# EAGLE schematic heated bed (EAGLE 6.2)
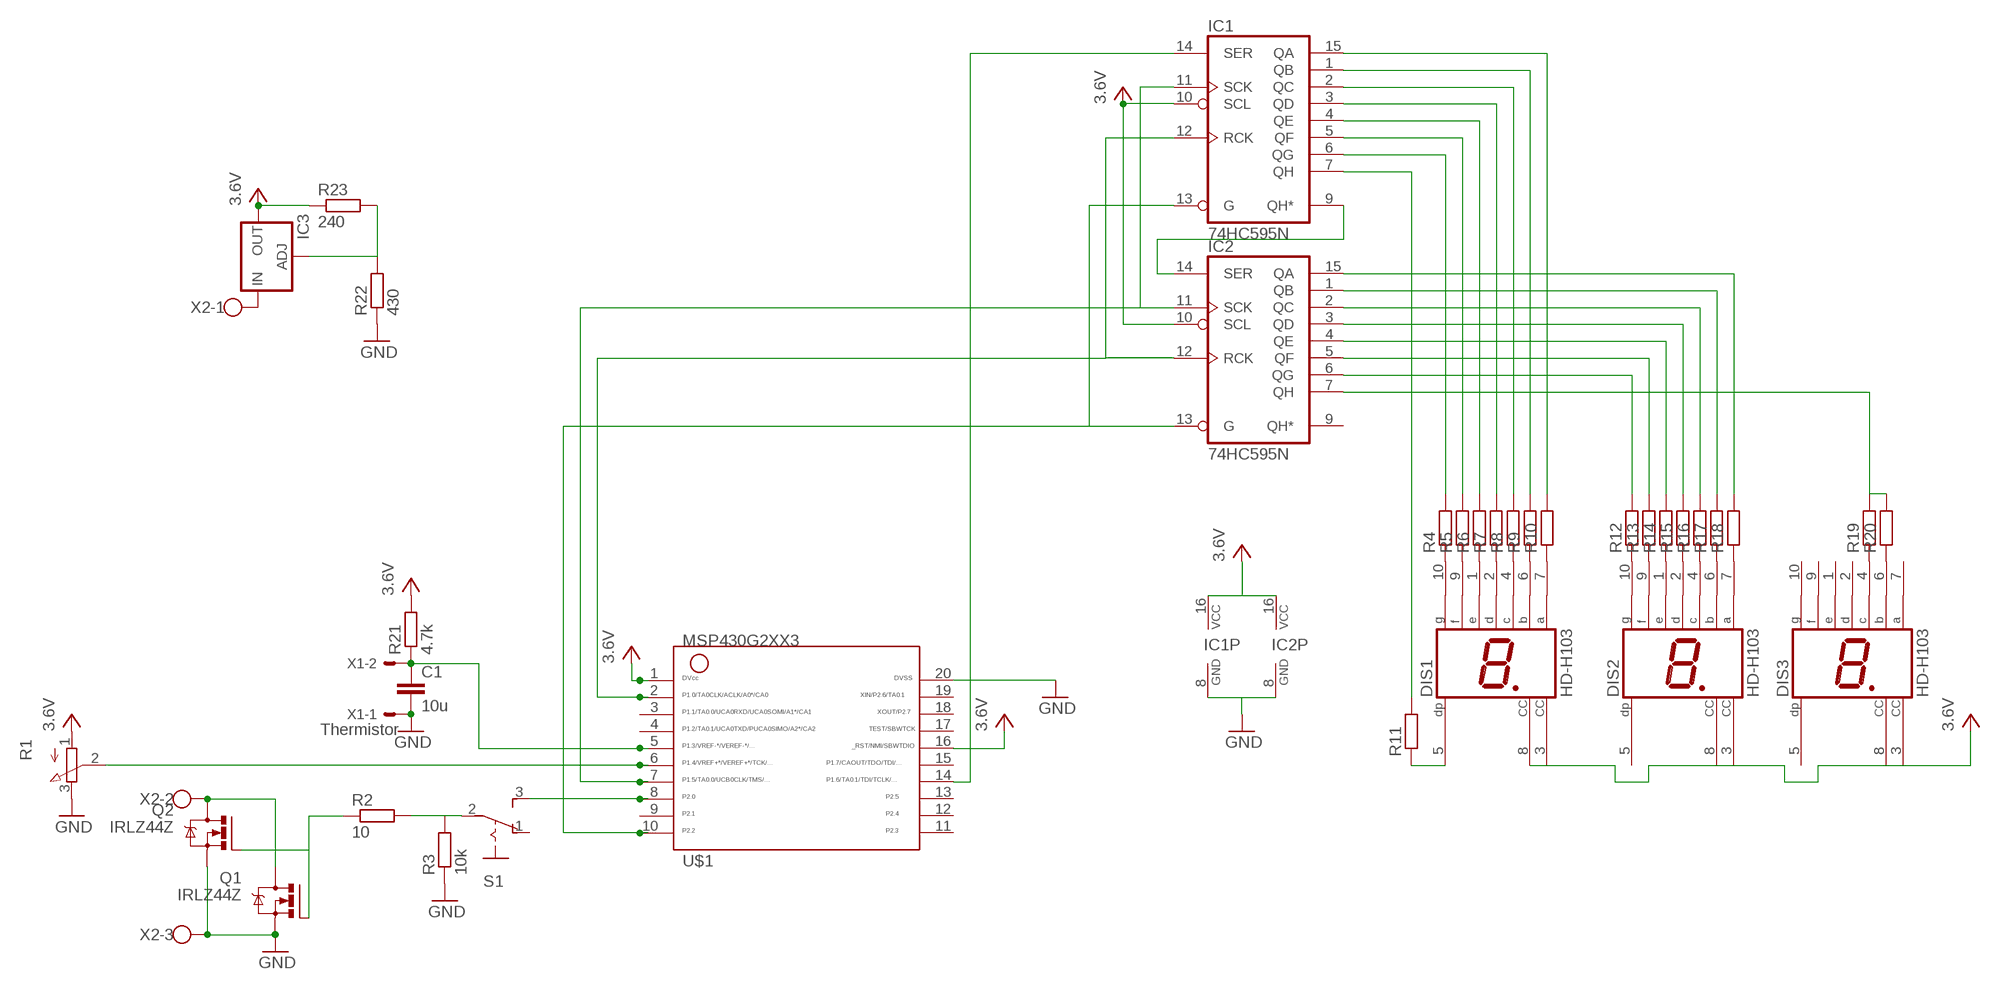
[diagram p0: schematic, sheet 1]

## Parts
C1  10u  C-EU025-050X050  [C025-050X050]
DIS1  HD-H103  [HDSP-M]
DIS2  HD-H103  [HDSP-M]
DIS3  HD-H103  [HDSP-M]
IC1  74HC595N  [DIL16]
IC2  74HC595N  [DIL16]
IC3  LM317L  [317L]
Q1  IRLZ44Z  [TO220BH]
Q2  IRLZ44Z  [TO220BH]
R1  3RP/1610N  [3RP/1610N]
R2  10  R-EU_0207/2V  [0207/2V]
R3  10k  R-EU_0207/2V  [0207/2V]
R4  R-EU_0207/2V  [0207/2V]
R5  R-EU_0207/2V  [0207/2V]
R6  R-EU_0207/2V  [0207/2V]
R7  R-EU_0207/2V  [0207/2V]
R8  R-EU_0207/2V  [0207/2V]
R9  R-EU_0207/2V  [0207/2V]
R10  R-EU_0207/2V  [0207/2V]
R11  R-EU_0207/2V  [0207/2V]
R12  R-EU_0207/2V  [0207/2V]
R13  R-EU_0207/2V  [0207/2V]
R14  R-EU_0207/2V  [0207/2V]
R15  R-EU_0207/2V  [0207/2V]
R16  R-EU_0207/2V  [0207/2V]
R17  R-EU_0207/2V  [0207/2V]
R18  R-EU_0207/2V  [0207/2V]
R19  R-EU_0207/2V  [0207/2V]
R20  R-EU_0207/2V  [0207/2V]
R21  4.7k  R-EU_0207/2V  [0207/2V]
R22  430  R-EU_0207/2V  [0207/2V]
R23  240  R-EU_0207/2V  [0207/2V]
S1  255SB  [255SB]
U$1  G2XX3---N20  [N20]
X1  Thermistor  22-23-2021  [22-23-2021]
X2  W237-103  [W237-103]

## Nets
GND: C1.2 IC1.8(GND) IC2.8(GND) Q1.S Q2.S R1.3(E) R3.1 R22.1 U$1.20 X1.1 X2.3
N$1: R1.2(S) U$1.6
N$2: IC1.11(SCK) IC2.11(SCK) U$1.7
N$3: R2.2 R3.2 S1.2(P)
N$4: IC1.12(RCK) IC2.12(RCK) U$1.2
N$5: IC1.9(QH*) IC2.14(SER)
N$6: IC1.13(G) IC2.13(G) U$1.10
N$7: DIS1.10(G) R4.1
N$8: DIS1.9(F) R5.1
N$9: DIS1.1(E) R6.1
N$10: DIS1.2(D) R7.1
N$11: DIS1.4(C) R8.1
N$12: DIS1.6(B) R9.1
N$13: DIS1.7(A) R10.1
N$14: DIS2.10(G) R12.1
N$15: DIS2.9(F) R13.1
N$16: DIS2.1(E) R14.1
N$17: DIS2.2(D) R15.1
N$18: DIS2.4(C) R16.1
N$19: DIS2.6(B) R17.1
N$20: DIS2.7(A) R18.1
N$21: DIS3.4(C) R19.1
N$22: DIS3.6(B) R20.1
N$23: DIS1.5(DP) R11.1
N$24: IC1.15(QA) R10.2
N$25: IC1.1(QB) R9.2
N$26: IC1.2(QC) R8.2
N$27: IC1.3(QD) R7.2
N$28: IC1.4(QE) R6.2
N$29: IC1.5(QF) R5.2
N$30: IC1.6(QG) R4.2
N$31: IC1.7(QH) R11.2
N$32: IC2.7(QH) R19.2 R20.2
N$33: IC2.15(QA) R18.2
N$34: IC2.1(QB) R17.2
N$35: IC2.2(QC) R16.2
N$36: IC2.3(QD) R15.2
N$37: IC2.4(QE) R14.2
N$38: IC2.5(QF) R13.2
N$39: IC2.6(QG) R12.2
N$40: S1.3(S) U$1.8
N$41: Q1.G Q2.G R2.1
N$42: Q1.D Q2.D X2.2
N$44: IC3.3(IN) X2.1
N$45: IC1.14(SER) U$1.14
N$47: C1.1 R21.1 U$1.5 X1.2
N$48: IC3.1(ADJ) R22.2 R23.2
VCC: DIS1.3(CC) DIS1.8(CC) DIS2.3(CC) DIS2.8(CC) DIS3.3(CC) DIS3.8(CC) IC1.10(SCL) IC1.16(VCC) IC2.10(SCL) IC2.16(VCC) IC3.2(OUT) R1.1(A) R21.2 R23.1 U$1.1 U$1.16 ; supply symbol labelled 3.6V
Unconnected: DIS2.5(DP) DIS3.1(E) DIS3.2(D) DIS3.5(DP) DIS3.7(A) DIS3.9(F) DIS3.10(G) IC2.9(QH*) S1.1(O) U$1.3 U$1.4 U$1.9 U$1.11 U$1.12 U$1.13 U$1.15 U$1.17 U$1.18 U$1.19

## Library data of the parts
C1 = rcl:C-EU: CAPACITOR, European symbol
DIS1-DIS3 = display-hp:HD-H103: LED DISPLAY 1-character 7 segment, decimal point right; OC_FARNELL: unknown; OC_NEWARK: unknown
IC1 IC2 = 74xx-eu:74*595: 8-bit SHIFT REGISTER, output latch
IC3 = v-reg:LM317L: VOLTAGE REGULATOR
Q1 Q2 = transistor-power:IRLZ44Z: N-Channel HEXFET® Power MOSFET Logic Level AUTOMOTIVE MOSFET Source: http://www.irf.com/product-info/datasheets/data/irlz44zpbf.pdf
R1 = pot:3RP/1610N: 16mm Potentiometer one level Source: http://www.alphapotentiometers.net/html/16mm_pot_2.html
R2-R23 = resistor:R-EU_: RESISTOR, European symbol
S1 = switch:255SB: SLIDING SWITCH Distributor Buerklin, 11G810
U$1 = TI_MSP430_v16:G2XX3---N20: MSP430G2XX1 PDIP (N) 20 Pin Package
X1 = con-molex:22-23-2021: .100" (2.54mm) Center Header - 2 Pin; MF: MOLEX; MPN: 22-23-2021; OC_FARNELL: 1462926; OC_NEWARK: 25C3832
X2 = con-wago-500:W237-103: WAGO SCREW CLAMP; MPN: 237-103; OC_FARNELL: unknown; OC_NEWARK: 18M7116